# Altium project Template_peripheral.PrjPcb
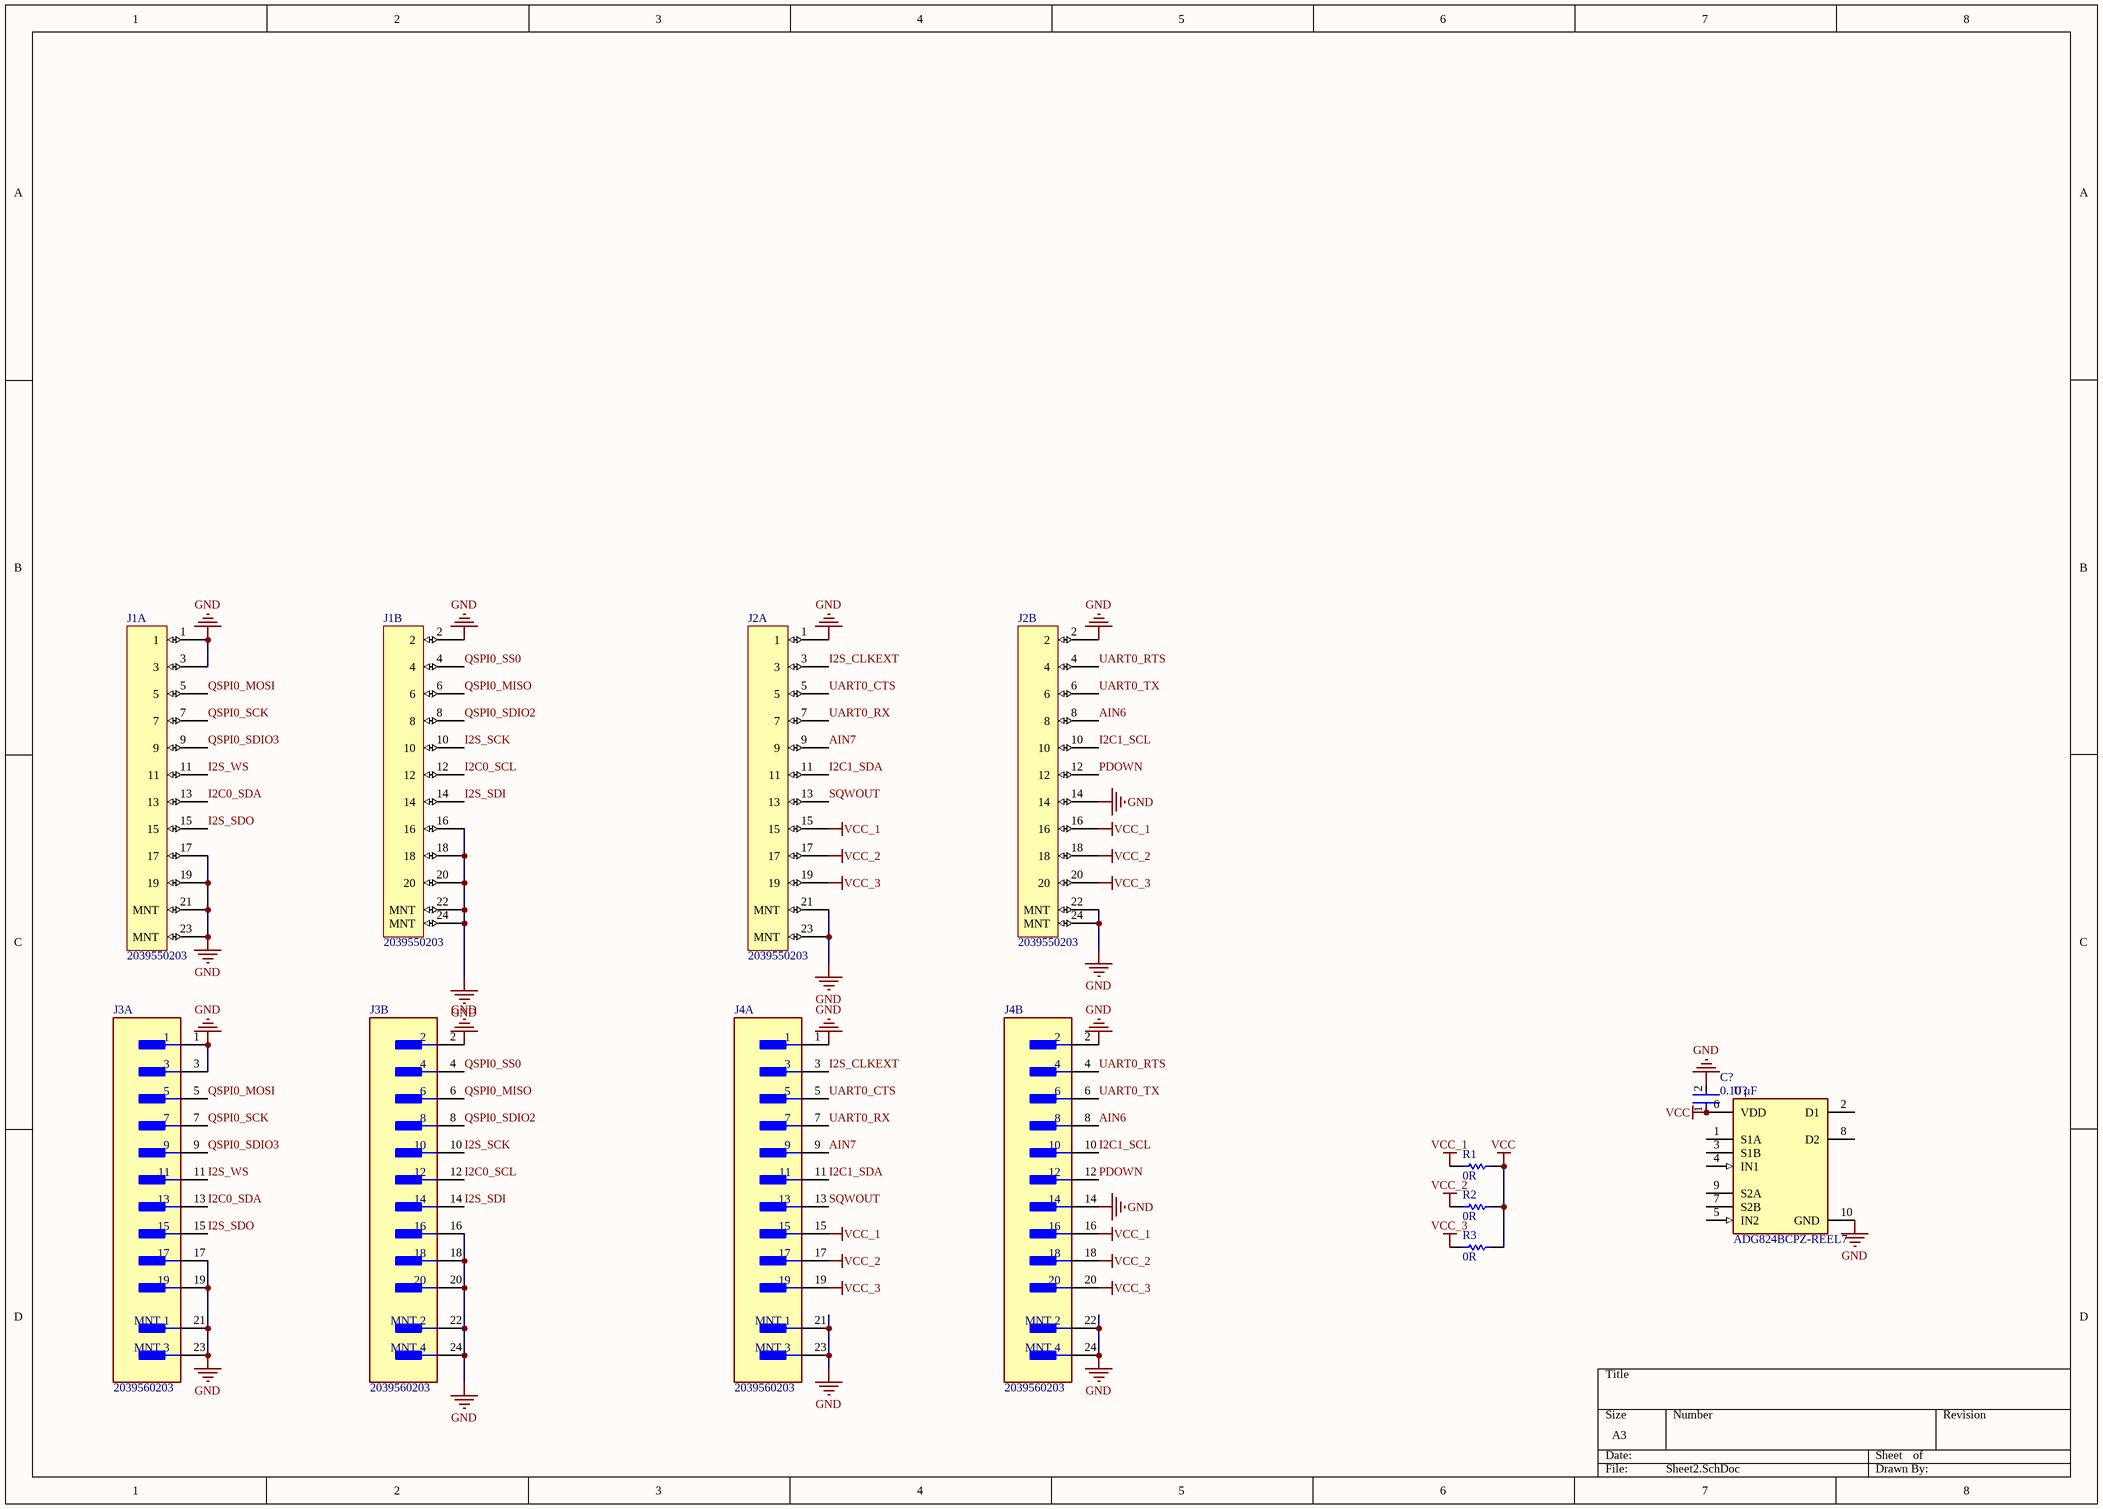
[diagram p0: Sheet2.SchDoc]
1 sheet, 9 parts. Net scope: global (net labels, ports and power ports of the same name join across sheets).
Board file: PCB3.PcbDoc

## Sheet Sheet2.SchDoc
size A3; SheetNumber: 1; SheetTotal: 1

### Parts
C?  Capacitance: 0.10 μF  [FP-C0402-BB-MFG]  (hidden comment: C0402C104K8PACTU)
J1  2039550203  [2039550203]  (parts A,B of 2)
J2  2039550203  [2039550203]  (parts A,B of 2)
J3  2039560203  [Molex_0_MFG]  (parts A,B of 2)
J4  2039560203  [Molex_0_MFG]  (parts A,B of 2)
R1  0R  [RESC1005X40X25NL05T10]
R2  0R  [RESC1005X40X25NL05T10]
R3  0R  [RESC1005X40X25NL05T10]
U?  ADG824BCPZ-REEL7  [FP-CP-10-10-MFG]

### Nets
GND: C?.2 J1.1 J1.2 J1.3 J1.16 J1.17 J1.18 J1.19 J1.20 J1.21(MNT) J1.22(MNT) J1.23(MNT) J1.24(MNT) J2.1 J2.2 J2.14 J2.21(MNT) J2.22(MNT) J2.23(MNT) J2.24(MNT) J3.1 J3.2 J3.3 J3.16 J3.17 J3.18 J3.19 J3.20 J3.21(MNT_1) J3.22(MNT_2) J3.23(MNT_3) J3.24(MNT_4) J4.1 J4.2 J4.14 J4.21(MNT_1) J4.22(MNT_2) J4.23(MNT_3) J4.24(MNT_4) U?.10(GND)
VCC: C?.1 R1.2 R2.2 R3.2 U?.6(VDD)
VCC_1: J2.15 J2.16 J4.15 J4.16 R1.1
VCC_2: J2.17 J2.18 J4.17 J4.18 R2.1
VCC_3: J2.19 J2.20 J4.19 J4.20 R3.1
AIN6: J2.8 J4.8
AIN7: J2.9 J4.9
I2C0_SCL: J1.12 J3.12
I2C0_SDA: J1.13 J3.13
I2C1_SCL: J2.10 J4.10
I2C1_SDA: J2.11 J4.11
I2S_CLKEXT: J2.3 J4.3
I2S_SCK: J1.10 J3.10
I2S_SDI: J1.14 J3.14
I2S_SDO: J1.15 J3.15
I2S_WS: J1.11 J3.11
PDOWN: J2.12 J4.12
QSPI0_MISO: J1.6 J3.6
QSPI0_MOSI: J1.5 J3.5
QSPI0_SCK: J1.7 J3.7
QSPI0_SDIO2: J1.8 J3.8
QSPI0_SDIO3: J1.9 J3.9
QSPI0_SS0: J1.4 J3.4
SQWOUT: J2.13 J4.13
UART0_CTS: J2.5 J4.5
UART0_RTS: J2.4 J4.4
UART0_RX: J2.7 J4.7
UART0_TX: J2.6 J4.6

Not connected (* = marked no-connect by the designer): U? 1(S1A) 2(D1) 3(S1B) 4(IN1) 5(IN2) 7(S2B) 8(D2) 9(S2A)

### Library data of the parts
C? = CMP-2008-02046-2: CAP CER 0.1UF 10V X5R 0402; Manufacturer: Kemet; Material: Ceramic; Temperature Coefficient: 15%; Tolerance: 0.1; Value: 0.10 μF; Package: C0402-BB; Temperature: -55°C to +125°C; ComponentLink2Description: Datasheet; Temperature Characteristic: X5R; Device Class L1: Passive Components; Height: 0.55mm; Lead Free: Yes; ComponentLink2URL: https://content.kemet.com/datasheets/KEM_C1002_X7R_SMD.pdf; Device Class L2: Capacitors; Temperature Range Low: -55°C; Temperature Range High: +125°C; RoHS: TRUE; Octopart: https://octopart.com/c0402c104k8pactu-kemet-140039; Automotive: No; Mouser Description: Capacitor 100 nF 10 VDC 0402; Category: Cap; Voltage Rating: 10 V; Digikey Description: CAP CER 0.1UF 10V X5R 0402; Ipc Land Pattern Name: CAPC10050X50; Device Class L3: Ceramic Capacitors; Manufacturer Part Number: C0402C104K8PACTU
J3 J4 = CMP-003-000000-1: 20 Position Connector Plug, Outer Shroud Contacts Surface Mount Gold; Manufacturer: Molex; Number Of Contacts: 20; Voltage Rating: 40V; Is Female: no; Symbol Hash: db22f1623fbfed54a22177e49599976dea34d6b12f98f445fc170047d3fb1d12; Conn Gender: Male; Verification Version: 0.0.0.3; Pitch: 0.4mm; Conn Orientation: Vertical; Current Rating: 0.3A; RoHS: TRUE; Digikey Description: CONN PLUG 20POS SMD GOLD; Automotive: No; Temperature Range High: +125°C; Temperature: -40°C to +125°C; Digikey Part Number: 900-2039560203CT-ND; Part Number: 2039560203; Footprint Url: https://www.molex.com/pdm_docs/sd/2039560203_sd.pdf; Lead Free: Yes; ComponentLink1URL: https://upverter.com/part/id/0a58283e91808ac4/; ComponentLink2URL: https://www.molex.com/webdocs/datasheets/pdf/en-us/2039560203_PCB_HEADERS.pdf; Contact Material: Gold,Nickel; Package: 0; Mouser Part Number: 538-203956-0203; Height: 4.55mm; Datasheet Path: datasheets/Conn_Molex_2039560203_eec.pdf; Number Of Rows: 2; ComponentLink1Description: Upverter; Temperature Range Low: -40°C; helpURL: https://upverter.com/part/id/0a58283e91808ac4/; ComponentLink2Description: Datasheet
R1-R3 = CMP-1011-00001-2: Manufacturer: Yageo / Phycomp; Part Number: RC0402JR-070RL
U? = CMP-09113-000012-1: IC SWITCH DUAL SPDT 10LFCSP; Manufacturer: Analog Devices; Nominal Supply Current: 0.003uA; Max Supply Voltage: 3.6V; Interface: LVCMOS; On State Resistance: 0.5Ω; -3Db Bandwith: 90MHz; Number Of Circuits: 2; Mux Demux Ratio: 1:2; Standoff Height: 0.02mm; Min Supply Voltage: 1.65V; Temperature: -40°C to +85°C; ComponentLink2URL: https://www.analog.com/media/en/technical-documentation/data-sheets/ADG824.pdf; Device Class L2: Interface ICs; Octopart: https://octopart.com/adg824bcpz-reel7-analog+devices-12410880; Temperature Range High: +85°C; Manufacturer Part Number: ADG824BCPZ-REEL7; Lead Free: Yes; Temperature Range Low: -40°C; ComponentLink2Description: Datasheet; Footprint Url: https://www.analog.com/media/en/symbols-footprints/symbols/ADG824BCPZ-REEL7.bxl; RoHS: TRUE; Device Class L3: Analog Switches; Device Class L1: Integrated Circuits (ICs); Automotive: No; Height: 0.6mm; Package: CP-10-10; Throw Configuration: SPDT; Category: IC; Digikey Description: IC SWITCH DUAL SPDT 10LFCSP